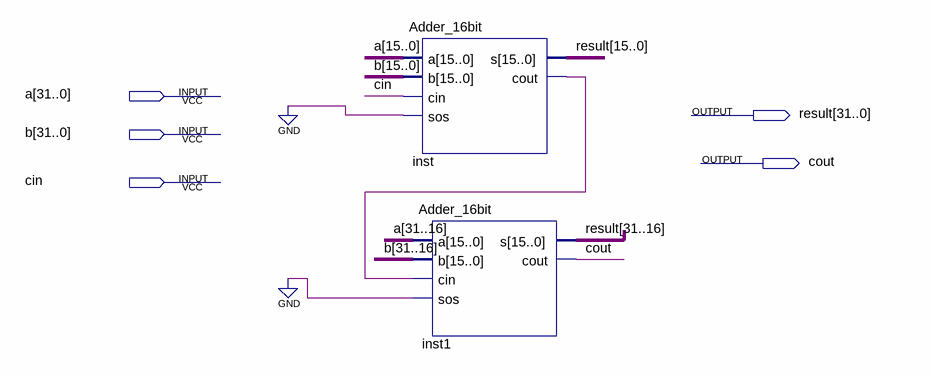
[diagram p0: schematic sheet]
// Quartus schematic Adder_32bit.bdf as structural Verilog: 2 symbols, 5 pins
module Adder_32bit (
  input  [31:0] a,
  input  [31:0] b,
  input  cin,
  output [31:0] result,
  output cout
);

  wire inst_cout;

  Adder_16bit inst (.a(a[15:0]), .b(b[15:0]), .cin(cin), .sos(1'b0), .s(result[15:0]), .cout(inst_cout));
  Adder_16bit inst1 (.a(a[31:16]), .b(b[31:16]), .cin(inst_cout), .sos(1'b0), .s(result[31:16]), .cout(cout));
endmodule
